# Altium schematic sheet MCU.SchDoc
size A4
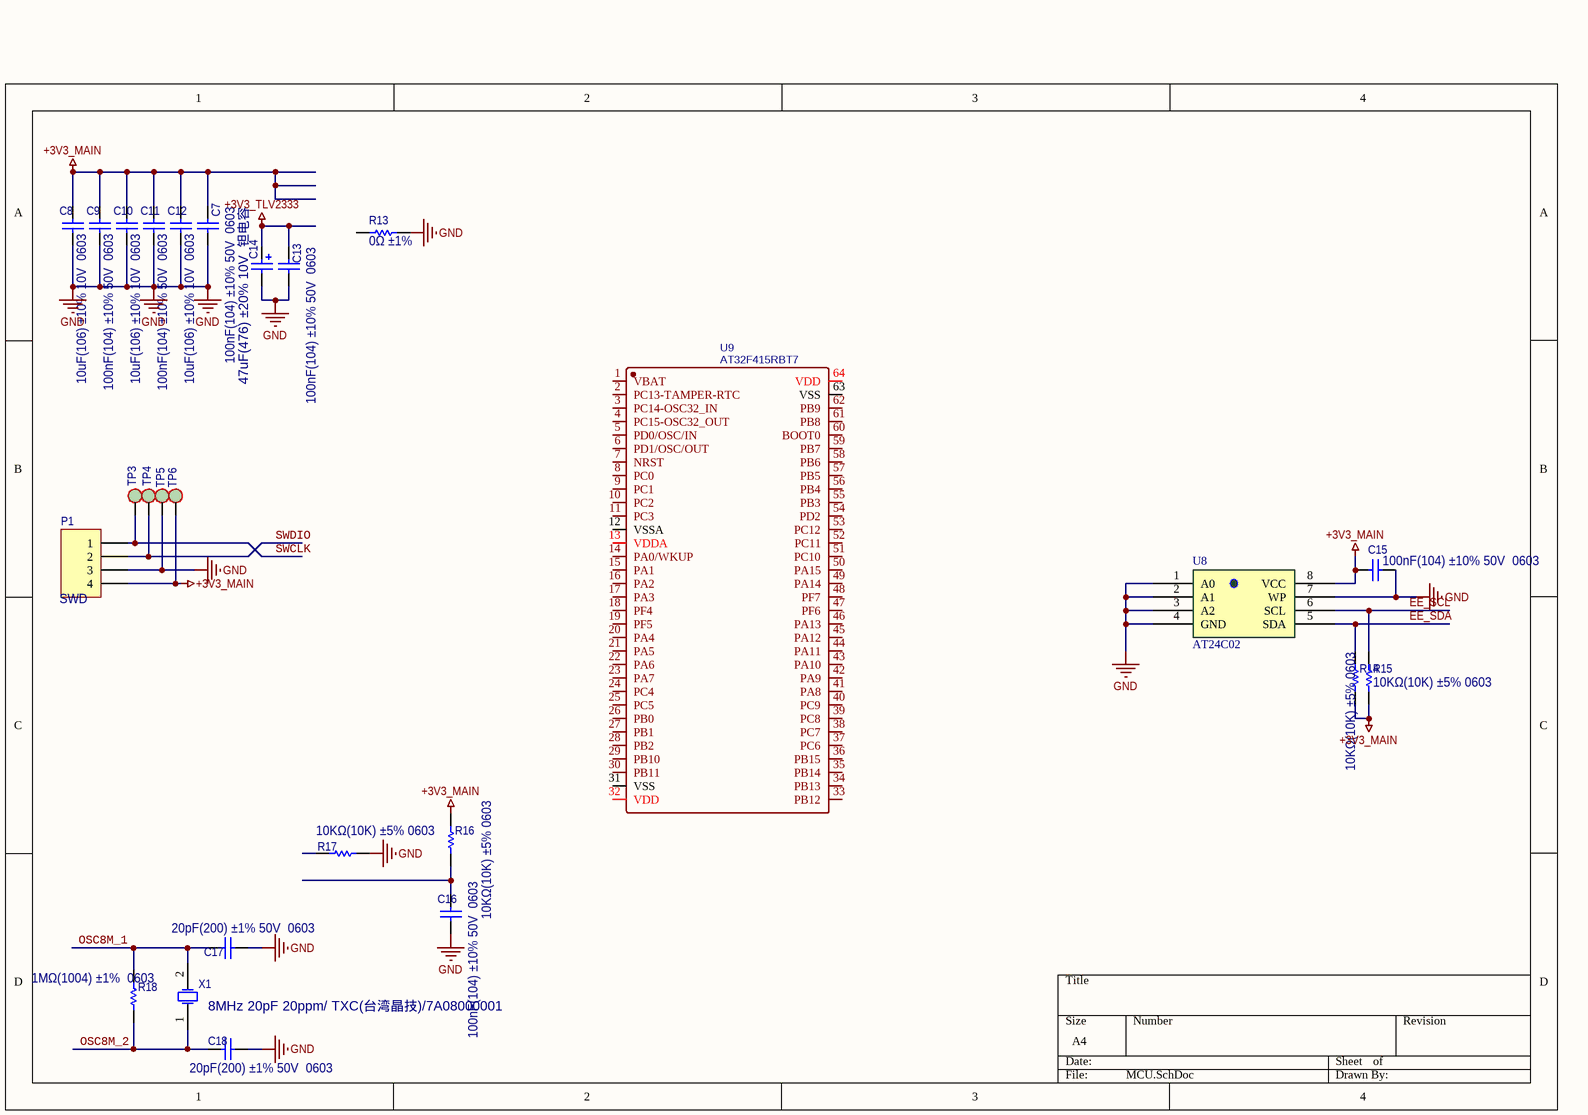
[diagram p0: MCU.SchDoc]

## Parts
C7  100nF(104) ±10% 50V  0603  [C0603]
C8  10uF(106) ±10% 10V  0603  [C0603]
C9  100nF(104) ±10% 50V  0603  [C0603]
C10  10uF(106) ±10% 10V  0603  [C0603]
C11  100nF(104) ±10% 50V  0603  [C0603]
C12  10uF(106) ±10% 10V  0603  [C0603]
C13  100nF(104) ±10% 50V  0603  [C0603]
C14  47uF(476) ±20% 10V  钽电容  [CASE-B_3528]
C15  100nF(104) ±10% 50V  0603  [C0603]
C16  100nF(104) ±10% 50V  0603  [C0603]
C17  20pF(200) ±1% 50V  0603  [C0603]
C18  20pF(200) ±1% 50V  0603  [C0603]
P1  SWD  [HDR1X4]
R13  0Ω ±1%  [R0603]
R14  10KΩ(10K) ±5% 0603  [R0603]
R15  10KΩ(10K) ±5% 0603  [R0603]
R16  10KΩ(10K) ±5% 0603  [R0603]
R17  10KΩ(10K) ±5% 0603  [R0603]
R18  1MΩ(1004) ±1%  0603  [R0603]
TP3  NC  [TP]  (value not drawn)
TP4  NC  [TP]  (value not drawn)
TP5  NC  [TP]  (value not drawn)
TP6  NC  [TP]  (value not drawn)
U8  AT24C02  [SOIC-8_150mil]
U9  AT32F415RBT7  [LQFP64]
X1  8MHz 20pF 20ppm/ TXC(台湾晶技)/7A08000001  [CRY5032_2P_SMT]

## Nets
+3V3_MAIN: C7.2 C8.2 C9.2 C10.2 C11.2 C12.2 C15.2 P1.4 R14.2 R15.2 R16.1 TP6.1 U8.8(VCC)
+3V3_TLV2333: C13.2 C14.1
GND: C7.1 C8.1 C9.1 C10.1 C11.1 C12.1 C13.1 C14.2 C15.1 C16.1 C17.1 C18.1 P1.3 R13.1 R17.1 TP5.1 U8.1(A0) U8.2(A1) U8.3(A2) U8.4(GND) U8.7(WP)
EE_SCL: R15.1 U8.6(SCL)
EE_SDA: R14.1 U8.5(SDA)
OSC8M_1: C17.2 R18.1 X1.2
OSC8M_2: C18.2 R18.2 X1.1
SWCLK: P1.1 TP3.1
SWDIO: P1.2 TP4.1
NetC16_2: C16.2 R16.2

Not connected (* = marked no-connect by the designer): R13 2; R17 2; U9 1(VBAT) 2(PC13-TAMPER-RTC) 3(PC14-OSC32_IN) 4(PC15-OSC32_OUT) 5(PD0/OSC/IN) 6(PD1/OSC/OUT) 7(NRST) 8(PC0) 9(PC1) 10(PC2) 11(PC3) 12(VSSA) 13(VDDA) 14(PA0/WKUP) 15(PA1) 16(PA2) 17(PA3) 18(PF4) 19(PF5) 20(PA4) 21(PA5) 22(PA6) 23(PA7) 24(PC4) 25(PC5) 26(PB0) 27(PB1) 28(PB2) 29(PB10) 30(PB11) 31(VSS) 32(VDD) 33(PB12) 34(PB13) 35(PB14) 36(PB15) 37(PC6) 38(PC7) 39(PC8) 40(PC9) 41(PA8) 42(PA9) 43(PA10) 44(PA11) 45(PA12) 46(PA13) 47(PF6) 48(PF7) 49(PA14) 50(PA15) 51(PC10) 52(PC11) 53(PC12) 54(PD2) 55(PB3) 56(PB4) 57(PB5) 58(PB6) 59(PB7) 60(BOOT0) 61(PB8) 62(PB9) 63(VSS) 64(VDD)

## Library data of the parts
C7-C13 C15-C18 = Cap: 0603贴片电容; Published: 8-Jun-2000; LatestRevisionDate: 17-Jul-2002; LatestRevisionNote: Re-released for DXP Platform.; PackageReference: RAD-0.3; Publisher: Altium Limited; PackageDescription: Radial Cap, Thru-Hole; 2 Leads; 0.3 in Pin Spacing
C14 = Cap Pol2: CASE_B 3528钽电容; Published: 8-Jun-2000; LatestRevisionDate: 17-Jul-2002; LatestRevisionNote: Re-released for DXP Platform.; PackageReference: POLAR0.8; Publisher: Altium Limited; PackageDescription: Polarized Capacitor; 2 Leads
P1 = Header 4: 编程下载口; LatestRevisionDate: 17-Jul-2002; LatestRevisionNote: Re-released for DXP Platform.; Publisher: Altium Limited
R13-R18 = Res1: 0603贴片电阻; Published: 8-Jun-2000; LatestRevisionDate: 17-Jul-2002; LatestRevisionNote: Re-released for DXP Platform.; PackageReference: AXIAL-0.3; Publisher: Altium Limited; PackageDescription: Axial Device, Thru-Hole; 2 Leads; 0.3 in Pin Spacing
TP3-TP6 = TP: 测试点
U8 = 24CXX: 非易失性存储器(ROM)
U9 = AT32F415RBT7: BOM_Manufacturer: Artery; Contributor: LCSC; BOM_Supplier: LCSC; BOM_Supplier Part: C528433; BOM_Manufacturer Part: AT32F415RBT7; BOM_JLCPCB Part Class: Extended Part; spicePre: U; spiceSymbolName: AT32F415RBT7
X1 = XTAL_SMD: 无源晶振  SMD-5032_2P; ERP: 0103040021; TOL: ±20ppm; Tolerate: ROSON -20_+70 20pf; PCB_Layout: Top Layer SMC; Value: 8MHz; Publisher: ZL_A0OFFICE; Revision: 2012-3-28